# Altium schematic sheet 1_P1.schdoc
size 309 x 223 mm; Symbol: Sheet-Symbol_A4; Device: Sheet-Symbol_A4; @Page Name: P1; @Create Date: 2025-03-08; @Page Count: 1; @Page No: 1; @Project Name: 编码电子锁; @Schematic Name: Schematic1; @Update Date: 2025-03-08; Company: 嘉立创EDA; Page Size: A4; Version: V1.0
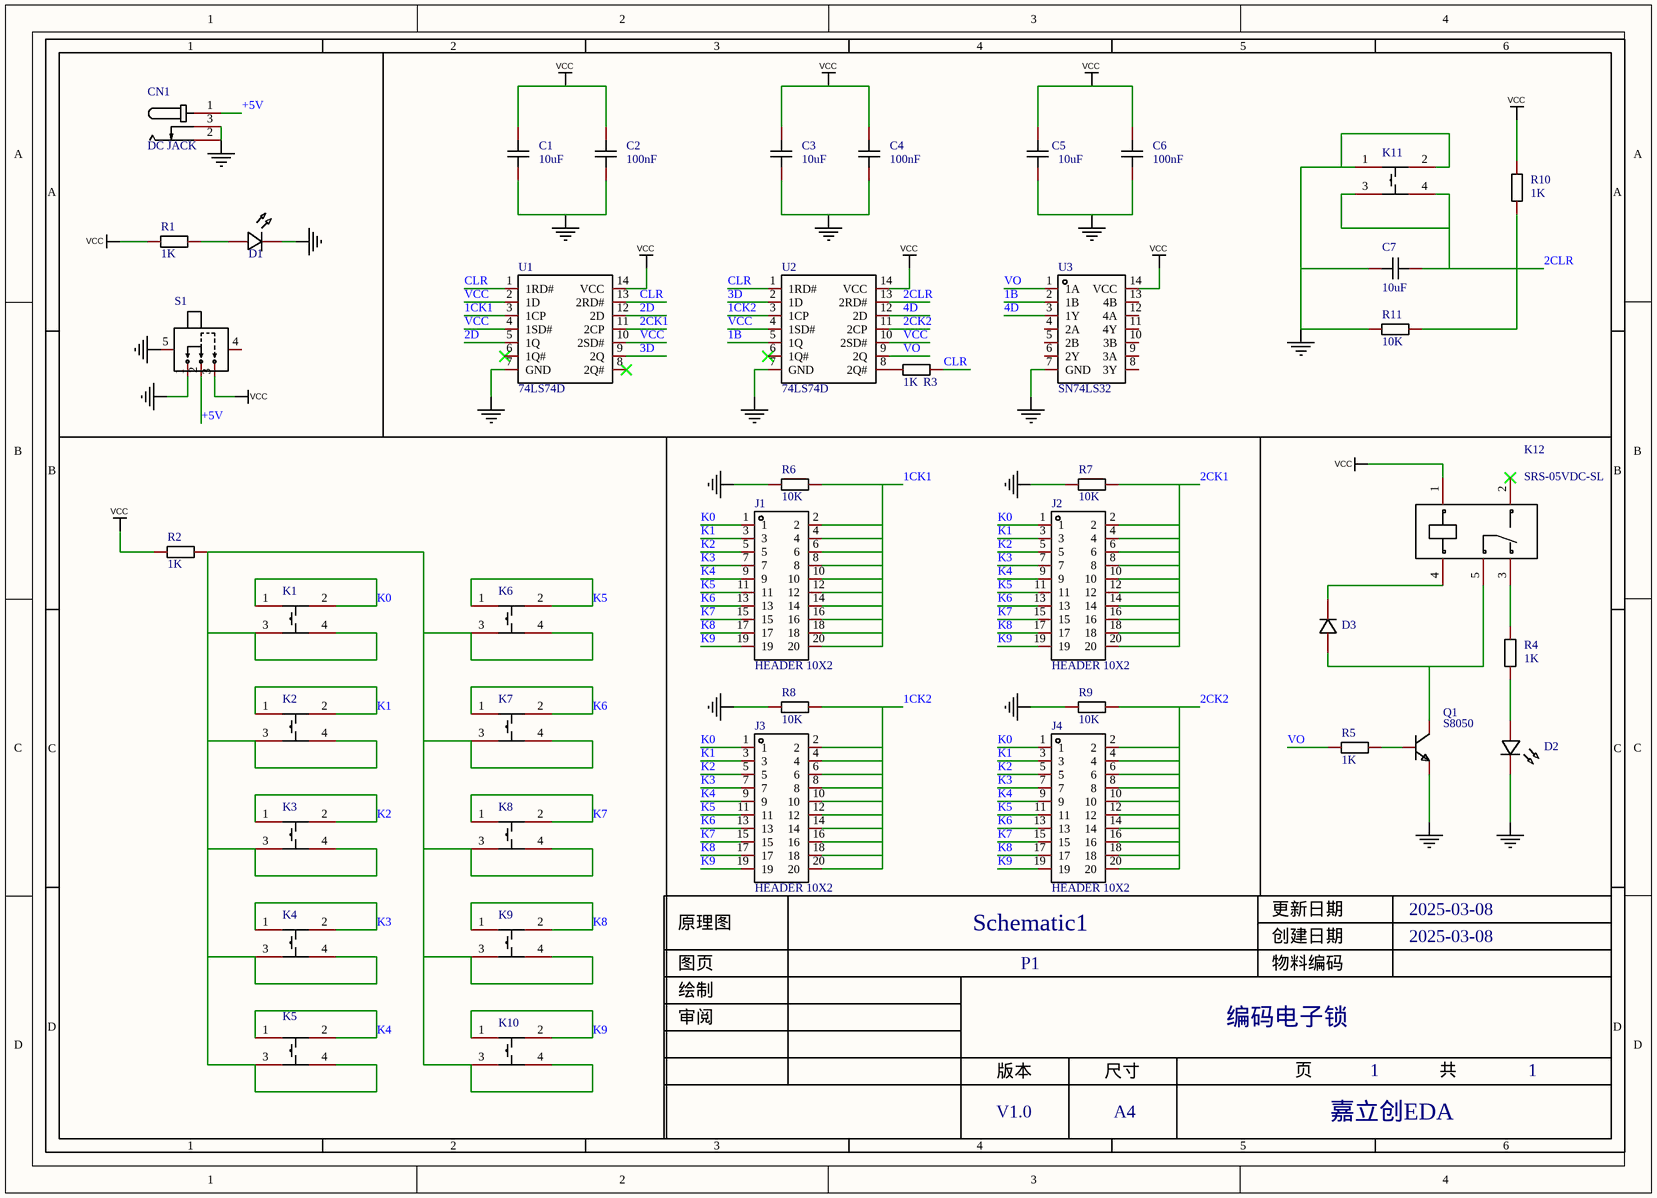
[diagram p0: 1_P1.schdoc]

## Parts
C1  10uF  [C0805]
C2  100nF  [C0805]
C3  10uF  [C0805]
C4  100nF  [C0805]
C5  10uF  [C0805]
C6  100nF  [C0805]
C7  10uF  [C0805]
CN1  DC JACK  [DC-IN-TH_DC005]
D1  LED_TH-R_3mm  [LED_TH-3mm]  (value not drawn)
D2  LED_TH-R_3mm  [LED_TH-3mm]  (value not drawn)
D3  LL4148-GS08  [SOD-80_L3.5-W1.5-RD]  (value not drawn)
J1  HEADER 10X2  [HDR-TH_20P-P2.54-V-M-R2-C10-S2.54]
J2  HEADER 10X2  [HDR-TH_20P-P2.54-V-M-R2-C10-S2.54]
J3  HEADER 10X2  [HDR-TH_20P-P2.54-V-M-R2-C10-S2.54]
J4  HEADER 10X2  [HDR-TH_20P-P2.54-V-M-R2-C10-S2.54]
K1  TS-1002S-04526C  [SW-SMD_4P-L6.0-W6.0-P4.50-LS9.0-2]  (value not drawn)
K2  TS-1002S-04526C  [SW-SMD_4P-L6.0-W6.0-P4.50-LS9.0-2]  (value not drawn)
K3  TS-1002S-04526C  [SW-SMD_4P-L6.0-W6.0-P4.50-LS9.0-2]  (value not drawn)
K4  TS-1002S-04526C  [SW-SMD_4P-L6.0-W6.0-P4.50-LS9.0-2]  (value not drawn)
K5  TS-1002S-04526C  [SW-SMD_4P-L6.0-W6.0-P4.50-LS9.0-2]  (value not drawn)
K6  TS-1002S-04526C  [SW-SMD_4P-L6.0-W6.0-P4.50-LS9.0-2]  (value not drawn)
K7  TS-1002S-04526C  [SW-SMD_4P-L6.0-W6.0-P4.50-LS9.0-2]  (value not drawn)
K8  TS-1002S-04526C  [SW-SMD_4P-L6.0-W6.0-P4.50-LS9.0-2]  (value not drawn)
K9  TS-1002S-04526C  [SW-SMD_4P-L6.0-W6.0-P4.50-LS9.0-2]  (value not drawn)
K10  TS-1002S-04526C  [SW-SMD_4P-L6.0-W6.0-P4.50-LS9.0-2]  (value not drawn)
K11  TS-1002S-04526C  [SW-SMD_4P-L6.0-W6.0-P4.50-LS9.0-2]  (value not drawn)
K12  SRS-05VDC-SL  [RELAY-TH_SRD-XXVDC-XL-C]
Q1  S8050  [SOT-23-3_L3.0-W1.7-P0.95-LS2.9-BR]
R1  1K  [R0805]
R2  1K  [R0805]
R3  1K  [R0805]
R4  1K  [R0805]
R5  1K  [R0805]
R6  10K  [R0805]
R7  10K  [R0805]
R8  10K  [R0805]
R9  10K  [R0805]
R10  1K  [R0805]
R11  10K  [R0805]
S1  SS12F44G5  [SW-TH_SHOU-HAN_SS12F44G4]  (value not drawn)
U1  74LS74D  [DIP-14_L19.1-W6.4-P2.54-LS7.6-BL]
U2  74LS74D  [DIP-14_L19.1-W6.4-P2.54-LS7.6-BL]
U3  SN74LS32  [PDIP-14_L19.6-W6.5-P2.54-LS7.9-BL]

## Nets
NetC1_1: C1.1 C2.1 C3.1 C4.1 C5.1 C6.1 C7.2 CN1.2 CN1.3 D1.2(A) D2.2(A) K11.1 K11.2 Q1.2(E) R6.1 R7.1 R8.1 R9.1 R11.2 S1.1 S1.5 U1.7(GND) U2.7(GND) U3.7(GND)
VCC: C1.2 C2.2 C3.2 C4.2 C5.2 C6.2 K12.1 R1.1 R2.1 R10.2 S1.3 U1.2(1D) U1.4(1SD#) U1.10(2SD#) U1.14(VCC) U2.4(1SD#) U2.10(2SD#) U2.14(VCC) U3.14(VCC)
1B: U2.5(1Q) U3.2(1B)
1CK1: J1.2 J1.4 J1.6 J1.8 J1.10 J1.12 J1.14 J1.16 J1.18 J1.20 R6.2 U1.3(1CP)
1CK2: J3.2 J3.4 J3.6 J3.8 J3.10 J3.12 J3.14 J3.16 J3.18 J3.20 R8.2 U2.3(1CP)
2CK1: J2.2 J2.4 J2.6 J2.8 J2.10 J2.12 J2.14 J2.16 J2.18 J2.20 R7.2 U1.11(2CP)
2CK2: J4.2 J4.4 J4.6 J4.8 J4.10 J4.12 J4.14 J4.16 J4.18 J4.20 R9.2 U2.11(2CP)
2CLR: C7.1 K11.3 K11.4 R10.1 R11.1 U2.13(2RD#)
2D: U1.5(1Q) U1.12(2D)
3D: U1.9(2Q) U2.2(1D)
4D: U2.12(2D) U3.3(1Y)
+5V: CN1.1 S1.2
CLR: R3.2 U1.1(1RD#) U1.13(2RD#) U2.1(1RD#)
K0: J1.1 J2.1 J3.1 J4.1 K1.1 K1.2
K1: J1.3 J2.3 J3.3 J4.3 K2.1 K2.2
K2: J1.5 J2.5 J3.5 J4.5 K3.1 K3.2
K3: J1.7 J2.7 J3.7 J4.7 K4.1 K4.2
K4: J1.9 J2.9 J3.9 J4.9 K5.1 K5.2
K5: J1.11 J2.11 J3.11 J4.11 K6.1 K6.2
K6: J1.13 J2.13 J3.13 J4.13 K7.1 K7.2
K7: J1.15 J2.15 J3.15 J4.15 K8.1 K8.2
K8: J1.17 J2.17 J3.17 J4.17 K9.1 K9.2
K9: J1.19 J2.19 J3.19 J4.19 K10.1 K10.2
VO: R5.1 U2.9(2Q) U3.1(1A)
NetD1_1: D1.1(C) R1.2
NetD2_1: D2.1(C) R4.1
NetD3_1: D3.1(C) K12.4
NetD3_2: D3.2(A) K12.5 Q1.3(C)
NetK1_3: K1.3 K1.4 K2.3 K2.4 K3.3 K3.4 K4.3 K4.4 K5.3 K5.4 K6.3 K6.4 K7.3 K7.4 K8.3 K8.4 K9.3 K9.4 K10.3 K10.4 R2.2
NetK12_3: K12.3 R4.2
NetQ1_1: Q1.1(B) R5.2
NetR3_1: R3.1 U2.8(2Q#)

Not connected (* = marked no-connect by the designer): K12 2*; S1 4; U1 6(1Q#)* 8(2Q#)*; U2 6(1Q#)*; U3 4(2A) 5(2B) 6(2Y) 8(3Y) 9(3A) 10(3B) 11(4Y) 12(4A) 13(4B)

## Notes on the sheet
- 1
- 2
- 3
- 4
- 5
- 6
- A
- B
- C
- 原理图
- Schematic1
- 创建日期
- 更新日期
- 2025-03-08
- 审阅
- 绘制
- 图页
- P1
- 物料编码
- 编码电子锁
- D
- 版本
- 尺寸
- 页
- 共
- V1.0
- A4
- 嘉立创EDA

## Library data of the parts
C1-C7 = CAP_0805: Symbol: CapAcitance; Convert to PCB: yes; Device: CAP_0805; Add into BOM: yes; Supplier Footprint: 0805
  C1 C3 C5 C7: Name: 10uF; Value: 10uF
  C2 C4 C6: Name: 100nF; Value: 100nF
CN1 = DC005: 连接器类型:DC电源插座;安装方式:弯插;触点内径:2mm;触点外径:6.3mm;额定电流:500mA;额定电压:30V;工作温度范围:-25℃~+70℃;; Manufacturer: SHOU HAN(首韩); Symbol: DC005_C431533; Add into BOM: yes; Connector Type: DC电源插座; Inside Contact Diameter: 2mm; Outside Contact Diameter: 6.3mm; Current Rating (Max): 500mA; Voltage Rating (Max): 30V; Name: DC JACK; Device: DC005; LCSC Part Name: DC电源插座 内径:2mm 外径:6.3mm; Supplier Part: C431533; Manufacturer Part: DC JACK; Supplier Footprint: 插件; Datasheet: https://atta.szlcsc.com/upload/public/pdf/source/20190925/C431533_4751811035784AC1D38EBC85F7905E99.pdf; Supplier: LCSC; Convert to PCB: yes; Mounting Style: 弯插; Operating Temperature Range: -25℃~+70℃
D1 D2 = LED_TH-R_3mm: Convert to PCB: yes; Symbol: LED_TH-R; Device: LED_TH-R_3mm; Add into BOM: yes; Supplier Footprint: 插件
D3 = LL4148-GS08: 二极管配置:-;正向压降(Vf):860mV@50mA;直流反向耐压(Vr):75V;平均整流电流(Io):300mA;功率:500mW;反向恢复时间(trr):8ns;; Manufacturer: VISHAY(威世); Add into BOM: yes; Reverse Voltage (Vr): 75V; Average Rectified Current (Io): 300mA; Power Dissipation: 500mW; Reverse Leakage Current: 5uA@75V; Reverse Recovery Time (trr): 8ns; Name: LL4148-GS08; Symbol: LL4148-GS08; Device: LL4148-GS08; LCSC Part Name: 电压:75V 电流:300mA; Supplier Part: C68883; Manufacturer Part: LL4148-GS08; Supplier Footprint: MiniMELF; Datasheet: https://atta.szlcsc.com/upload/public/pdf/source/20160803/1470206543327.pdf; Supplier: LCSC; Convert to PCB: yes; Diode Configuration: -; Forward Voltage (Vf@If): 860mV@50mA; Operating Temperature: -
J1-J4 = 2.54-2*10: 插针结构:2x10P;间距:2.54mm;排数:双排;总PIN位数:20P;; Manufacturer: ZHOURI(洲日); Add into BOM: yes; Pin Structure: 2x10P; Pitch: 2.54mm; Name: HEADER 10X2; Symbol: 2.54-2*10; Device: 2.54-2*10; LCSC Part Name: 2.54-2*10; Supplier Part: C5116480; Manufacturer Part: HEADER 10X2; Supplier Footprint: 插件,P=2.54mm; Datasheet: https://atta.szlcsc.com/upload/public/pdf/source/20220412/C6BEA3D643D1CE07163CD717B50927E0.pdf; Supplier: LCSC; Convert to PCB: yes; Number of Rows: 双排; Number of Pins: 20P
K1-K11 = TS-1002S-04526C: 电路结构:单刀单掷;按钮形状:圆形按钮;安装方式:立贴;开关长度:6mm;开关宽度:6mm;开关高度:4.5mm;触点电流:50mA;额定电压(DC):12V;带灯:-;机械寿命:-;; Manufacturer: XUNPU(讯普); Add into BOM: yes; Circuit: 单刀单掷; Actuator Style: 圆形按钮; Switch Length: 6mm; Switch Height: 4.5mm; Contact Current: 50mA; Voltage Rating (DC): 12V; Name: TS-1002S-04526C; Symbol: TS-1002S-04526C; Device: TS-1002S-04526C; LCSC Part Name: 6*6*4.5mm 立贴 轻触开关; Supplier Part: C455109; Manufacturer Part: TS-1002S-04526C; Supplier Footprint: SMD,6x6mm; Datasheet: https://atta.szlcsc.com/upload/public/pdf/source/20191118/C455126_F61E8FA1ED640FB1CE0B30B55DEB62E3.pdf; Supplier: LCSC; Convert to PCB: yes; Mounting Style: 立贴; Switch Width: 6mm; With Lamp: -; Mechanical Life: -
K12 = SRD-05VDC-SL-C: 线圈电压:5V;触点形式:一组转换:1C(单刀双掷-转换);触点容量(电阻负载):-;最大切换电压:250V@AC;最大切换电流:15A;; Manufacturer: 松乐; Add into BOM: yes; Coil Voltage: 5V; Pin Number: 5; Coil Rated Power: 360mW; Maximum Switching Current: 15A; Coil Type: 无极性-单线圈; Coil Resistance: 70Ω; Contact Resistance: 100mΩ; Operate Time: 10ms; Name: SRS-05VDC-SL; Symbol: SRD-05VDC-SL-C; Device: SRD-05VDC-SL-C; LCSC Part Name: 蓝色; Supplier Part: C35449; Manufacturer Part: SRS-05VDC-SL; Supplier Footprint: 插件,15.6x19.2mm; Datasheet: https://atta.szlcsc.com/upload/public/pdf/source/20200305/C490149_C96E4098A3B1FFB377D5AD2E40B7C2A8.pdf; Supplier: LCSC; Convert to PCB: yes; Contact Form: 一组转换:1C(单刀双掷-转换); Contact Rating: -; Maximum Switching Voltage: 250V@AC; Release Time: 10ms
Q1 = S8050-J3Y: 晶体管类型:NPN;集电极电流(Ic):500mA;集射极击穿电压(Vceo):25V;耗散功率(Pd):300mW;直流电流增益(hFE):120@500mA,1V;; Manufacturer: MDD(辰达半导体); Add into BOM: yes; type: NPN; Current - Collector(Ic): 500mA; Collector - Emitter Voltage VCEO: 25V; Pd - Power Dissipation: 300mW; Transition frequency(fT): 150MHz; Current - Collector Cutoff: 100nA; Vce Saturation(VCE(sat)): 600mV; Name: S8050; Symbol: S8050-J3Y; Device: S8050-J3Y; LCSC Part Name: S8050-J3Y; Supplier Part: C364312; Manufacturer Part: S8050; Supplier Footprint: SOT-23; Datasheet: https://atta.szlcsc.com/upload/public/pdf/source/20241121/97BBBA232BCC69760BB5FA02C7A73959.pdf; Supplier: LCSC; Convert to PCB: yes; DC Current Gain: 120@500mA,1V; Operating Temperature: -55℃~+150℃
R1-R11 = Res_0805: Symbol: 电阻; Convert to PCB: yes; Device: Res_0805; Add into BOM: yes; Supplier Footprint: 0805
  R1-R5 R10: Name: 1K; Value: 1K
  R6-R9 R11: Name: 10K; Value: 10K
S1 = SS12F44G5: 拨动开关 立式直脚插件 二档 柄高5mm; Manufacturer: HanElectricity(瀚源); Add into BOM: yes; Name: SS12F44G5; Symbol: SS12F44G5; Device: SS12F44G5; LCSC Part Name: SS12F44G5; Supplier Part: C22435641; Manufacturer Part: SS12F44G5; Supplier Footprint: 插件-5P,12.2x5.5mm; Datasheet: https://atta.szlcsc.com/upload/public/pdf/source/20240521/251CCE5309E68669C05257185F219EB8.pdf; Supplier: LCSC; Convert to PCB: yes
U1 U2 = SN74LS74N: 类型:D-型;工作电压:2V~6V;时钟频率(fc):82MHz;元件数:2;每个元件位数:1;静态电流(Iq):40uA;; Manufacturer: LX(灵星芯微); Add into BOM: yes; Trigger Type: 上升沿; Voltage - Supply: 2V~6V; Clock Frequency: 82MHz; Function: 置位和复位; Number of Elements: 2; Number of Bits per Element: 1; Output Type: 互补型; Current - Output Low(IOL): 5.2mA; Quiescent Current: 40uA; Name: 74LS74D; Symbol: SN74LS74N; Device: SN74LS74N; LCSC Part Name: SN74LS74N; Supplier Part: C22466308; Manufacturer Part: 74LS74D; Supplier Footprint: DIP-14; Datasheet: https://atta.szlcsc.com/upload/public/pdf/source/20240614/A3AE1E265392141761706CE1278B9875.pdf; Supplier: LCSC; Convert to PCB: yes; Type: D-型; Series: 74LS系列; Current - Output High(IOH): 5.2mA; Operating Temperature: -40℃~+125℃
U3 = SN74LS32N: 逻辑类型:或门;通道数:4;电源电压:4.75V~5.25V;最大传播延迟:22ns@5V,15pF;; Manufacturer: TI(德州仪器); Add into BOM: yes; Logic Gate Type: 或门; Number of Channels: 4; Sink Current: 8mA; Source Current: 400uA; High Level Range (VIH): 2V; Low Level Range (VIL): 800mV; Name: SN74LS32; Symbol: SN74LS32N; Device: SN74LS32N; LCSC Part Name: SN74LS32N; Supplier Part: C273644; Manufacturer Part: SN74LS32; Supplier Footprint: PDIP-14; Datasheet: https://www.ti.com/cn/lit/gpn/sn74ls32; Supplier: LCSC; Convert to PCB: yes; Supply Voltage: 4.75V~5.25V; Series: 74LS系列; Propagation Delay Time: 22ns@5V,15pF; Operating Temperature: 0℃~+70℃